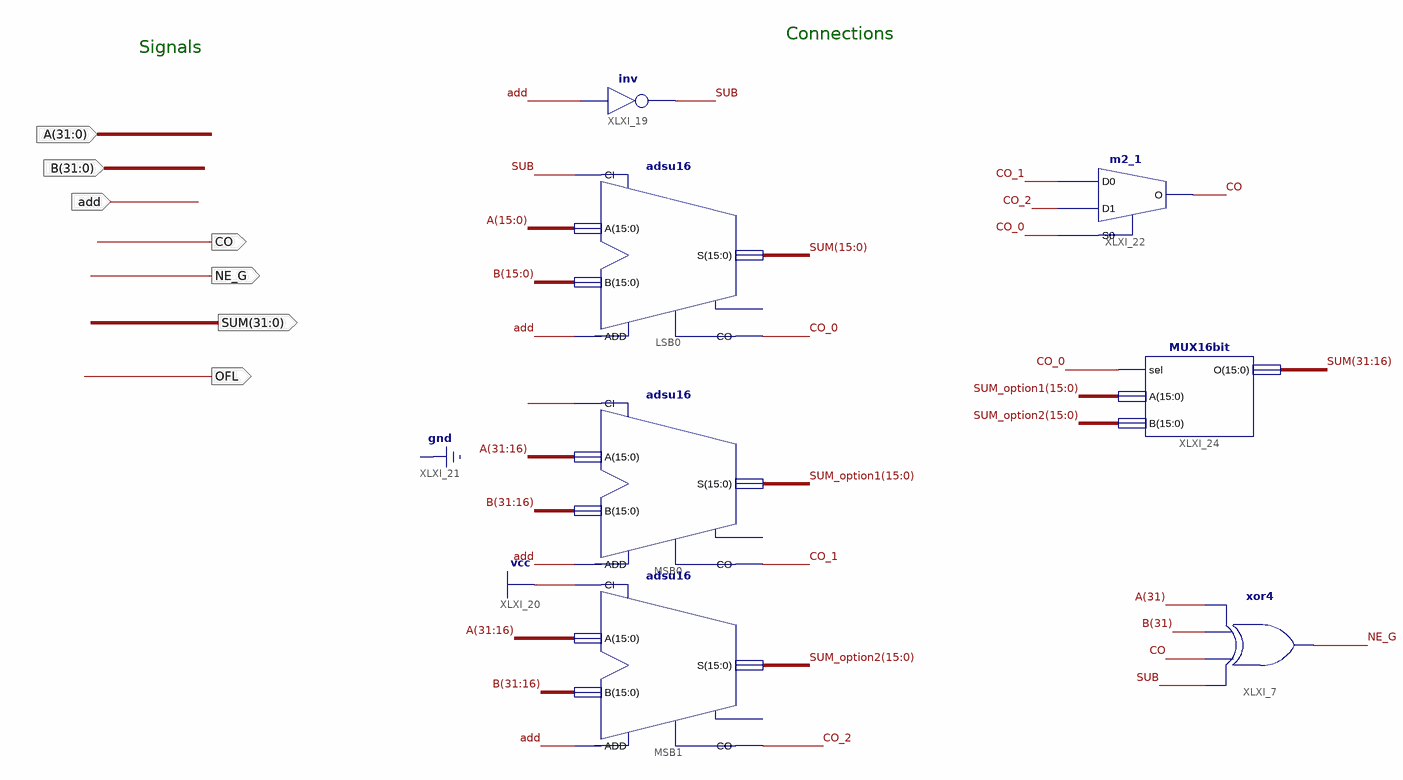
[diagram p0: schematic sheet 1]
// Xilinx ISE schematic ALU_ADDER.sch (spartan6) as structural Verilog: 7 symbols, 7 ports
module ALU_ADDER (
  input  [31:0] B,
  input  [31:0] A,
  input  add,
  output NE_G,
  output [31:0] SUM,
  output OFL,
  output CO
);

  wire CO_0, CO_1, CO_2, SUB;
  wire [15:0] SUM_option1, SUM_option2;

  xor XLXI_7 (NE_G, SUB, CO, B[31], A[31]);
  adsu16 LSB0 (.A(A[15:0]), .ADD(add), .B(B[15:0]), .CI(SUB), .CO(CO_0), .S(SUM[15:0]));  // open: OFL
  adsu16 MSB0 (.A(A[31:16]), .ADD(add), .B(B[31:16]), .CI(1'b0), .CO(CO_1), .S(SUM_option1));  // open: OFL
  adsu16 MSB1 (.A(A[31:16]), .ADD(add), .B(B[31:16]), .CI(1'b1), .CO(CO_2), .S(SUM_option2));  // open: OFL
  not XLXI_19 (SUB, add);
  m2_1 XLXI_22 (.D0(CO_1), .D1(CO_2), .S0(CO_0), .O(CO));
  MUX16bit XLXI_24 (.sel(CO_0), .A(SUM_option1), .B(SUM_option2), .O(SUM[31:16]));

  // Notes on the sheet:
  //   Connections
  //   Signals
endmodule
